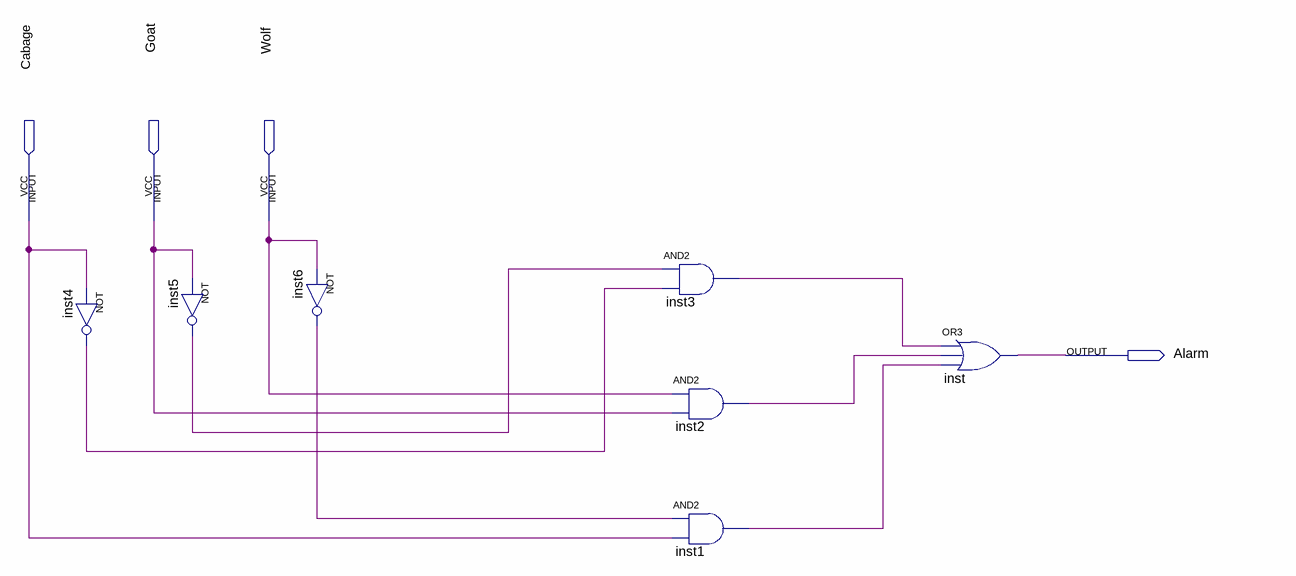
[diagram p0: schematic sheet]
// Quartus schematic lab2step2.bdf as structural Verilog: 7 symbols, 4 pins
module lab2step2 (
  input  Cabage,
  input  Goat,
  input  Wolf,
  output Alarm
);

  wire inst1_out, inst2_out, inst3_out, inst4_out, inst5_out, inst6_out;

  not inst4 (inst4_out, Cabage);
  not inst5 (inst5_out, Goat);
  not inst6 (inst6_out, Wolf);
  and inst3 (inst3_out, inst5_out, inst4_out);
  and inst2 (inst2_out, Wolf, Goat);
  and inst1 (inst1_out, inst6_out, Cabage);
  or inst (Alarm, inst3_out, inst2_out, inst1_out);
endmodule
